# Altium schematic sheet 01_cover.SchDoc: =Proj_Title
size B; Address1: Haleiwa, HI 96712 USA; SheetNumber: 1
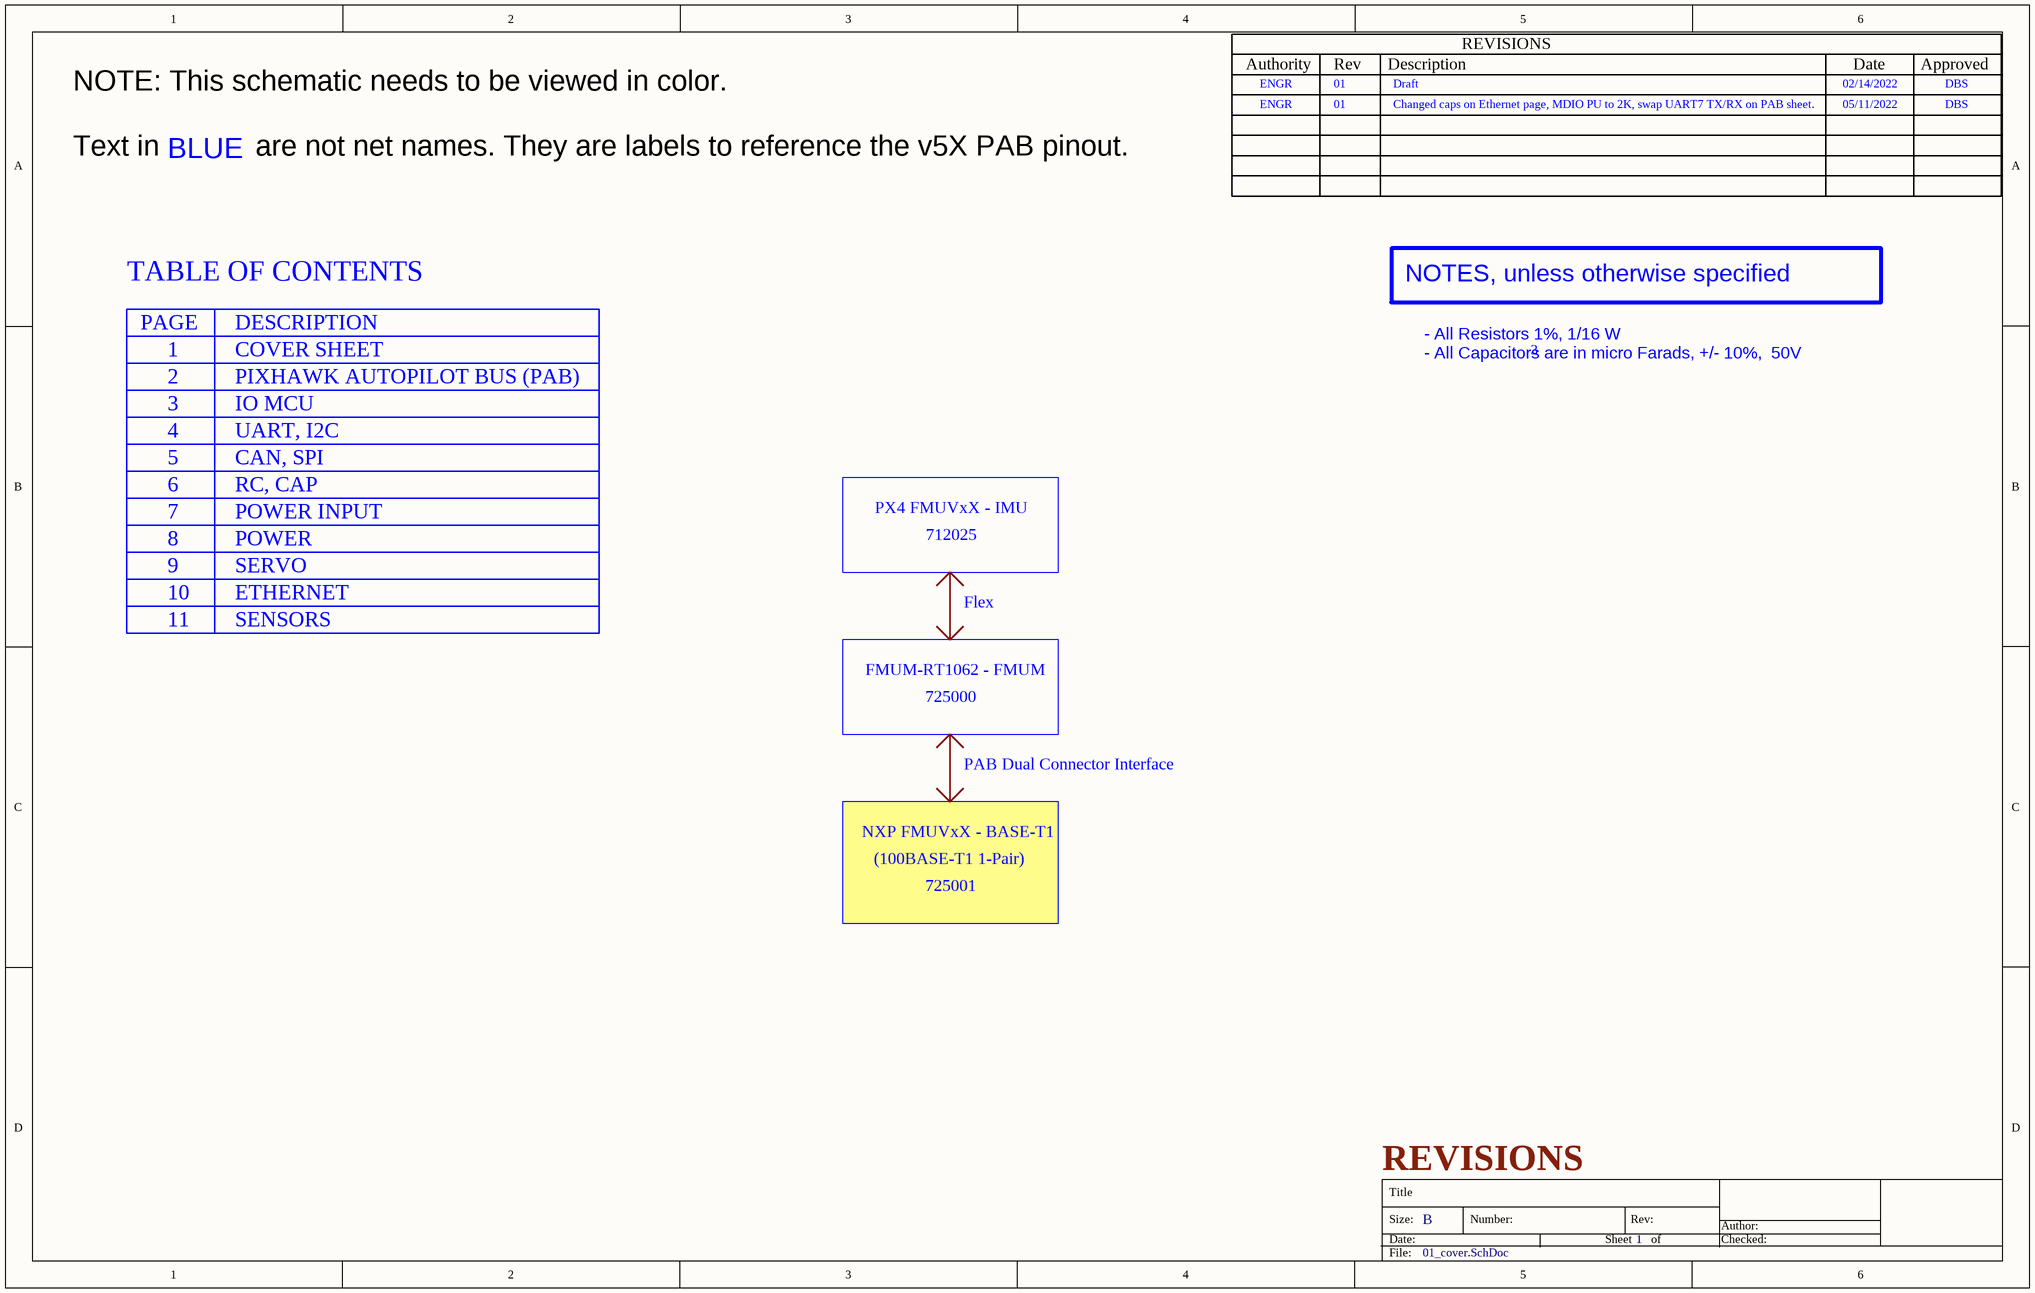
[diagram p0: 01_cover.SchDoc]

## Parts
*  REVISION_BLOCK  (value not drawn)  (graphical)

## Notes on the sheet
- (near *) ENGR
- 01
- Draft
- 02/14/2022
- DBS
- ENGR
- Changed caps on Ethernet page, MDIO PU to 2K, swap UART7 TX/RX on PAB sheet.
- 05/11/2022
- (near *) NOTE: This schematic needs to be viewed in color.
  Text in            are not net names. They are labels to reference the v5X PAB pinout.
- BLUE
- TABLE OF CONTENTS
- NOTES, unless otherwise specified
- PAGE
- 1
- DESCRIPTION
- COVER SHEET
- 3
- 2
- PIXHAWK AUTOPILOT BUS (PAB)
- IO MCU
- - All Resistors 1%, 1/16 W
  - All Capacitors are in micro Farads, +/- 10%,  50V
- 4
- 5
- 6
- UART, I2C
- CAN, SPI
- RC, CAP
- 7
- 8
- POWER INPUT
- POWER
- PX4 FMUVxX - IMU
- 712025
- 9
- 10
- 11
- SERVO
- ETHERNET
- SENSORS
- Flex
- FMUM-RT1062 - FMUM
- 725000
- PAB Dual Connector Interface
- NXP FMUVxX - BASE-T1
- (100BASE-T1 1-Pair)
- 725001
- REVISIONS
- Title
- Size:
- Date:
- B
- Number:
- Sheet
- Rev:
- of
- Author:
- Checked:
- File:
- (in symbol REVISION_BLOCK) REVISIONS; Authority; Rev; Description; Date; Approved